# Altium schematic sheet REF_LED.SchDoc
size A4; SheetNumber: 5; SheetTotal: 8
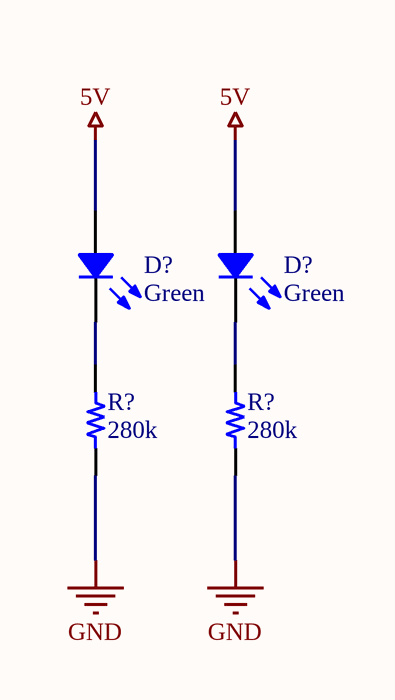
[diagram p0: REF_LED.SchDoc]

## Parts
(Parts that share a designator on the sheet are numbered #1, #2 ... from top to bottom, then left to right.)
D?#1  Green  [LED 0603/1608 GREEN]
D?#2  Green  [LED 0603/1608 GREEN]
R?#1  280k  [RES 1206/3216]
R?#2  280k  [RES 1206/3216]

## Nets
5V: D?#1.1 D?#2.1
GND: R?#1.2 R?#2.2
NetD?#1_2: D?#1.2 R?#1.1
NetD?#2_2: D?#2.2 R?#2.1

## Library data of the parts
D?#1 D?#2 = HSMQ-C191: LED GREEN DIFFUSED 0603 SMD; Manufacturer: Avago Technologies US Inc.; Type: Surface Mount; Millicandela: 145mcd; Voltage Forward: 3.4V; Current (Test): 20mA; Viewing Angle: 140; Value: Green; Part Number: HSMQ-C191; PartId: 7059; Supplier 1: Digi-Key; Supplier Part Number 1: 516-1807-2-ND; ComponentLink1Description: Datasheet; ComponentLink1URL: http://www.avagotech.com/docs/AV02-0977EN; ComponentLink2Description: Digi-Key Listing; ComponentLink2URL: http://www.digikey.ca/product-detail/en/HSMQ-C191/516-1807-2-ND/1012398; Price: 0.4769; Device Package: 0603 (1608 Metric); Colour: Green; Lens Transparency: Diffused
R?#1 R?#2 = ERA-8AEB2803V: RES SMD 280K OHM 0.1% 1/4W 1206; Manufacturer: Panasonic Electronic Components; TemperatureRange: -55C ~ 155C; TemperatureCoefficient: 25ppm/C; PowerRating: 0.25W, 1/4W; Value: 280k; Part Number: ERA-8AEB2803V; PartId: 3611; Supplier 1: Digi-Key; Supplier Part Number 1: P280KBCTR-ND; ComponentLink1Description: Datasheet; ComponentLink1URL: http://industrial.panasonic.com/lecs/www-data/pdf/AOA0000/AOA0000CE26.pdf; ComponentLink2Description: Digi-Key listing; ComponentLink2URL: http://digikey.com/product-detail/en/ERA-8AEB2803V/P280KBCTR-ND/3070936; Tolerance: 0.1%; Price: 0.1954; Type: Thin Film; Device Package: 1206 (3216 Metric)